# EAGLE design uSupply_upgrade (EAGLE 6.4)

## Sheet 1 of 3: MCU Power
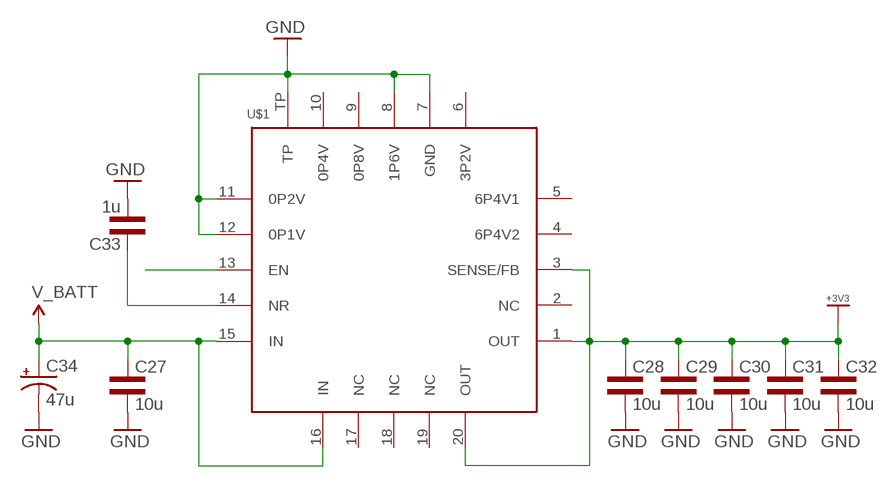
[diagram p0: schematic, sheet 1]

### Parts
C27  10u  CAP0805L3  [0805L3]
C28  10u  CAP0805L3  [0805L3]
C29  10u  CAP0805L3  [0805L3]
C30  10u  CAP0805L3  [0805L3]
C31  10u  CAP0805L3  [0805L3]
C32  10u  CAP0805L3  [0805L3]
C33  1u  CAP0603L3  [0603L3]
C34  47u  CPOL-USCT7343  [CT7343]
U$1  POWER-SUPPLY_POS_V1_TI_LDO_TPS7A4700  [POWER-SUPPLY_POS_V1_TI_LDO_VQFN-20]

### Nets
+3V3: C28.1 C29.1 C30.1 C31.1 C32.1 U$1.1(OUT) U$1.3(SENSE/FB) U$1.20(OUT) ; also sheet 2,3
GND: C27.2 C28.2 C29.2 C30.2 C31.2 C32.2 C33.P$2 C34.- U$1.7(GND) U$1.8(1P6V) U$1.11(0P2V) U$1.12(0P1V) U$1.TP ; also sheet 2,3
N$29: C33.P$1 U$1.14(NR)
N$33: U$1.13(EN)
V_BATT: C27.1 C34.+ U$1.15(IN) U$1.16(IN) ; also sheet 3
Unconnected: U$1.2(NC) U$1.4(6P4V2) U$1.5(6P4V1) U$1.6(3P2V) U$1.9(0P8V) U$1.10(0P4V) U$1.17(NC) U$1.18(NC) U$1.19(NC)

## Sheet 2 of 3: MCU
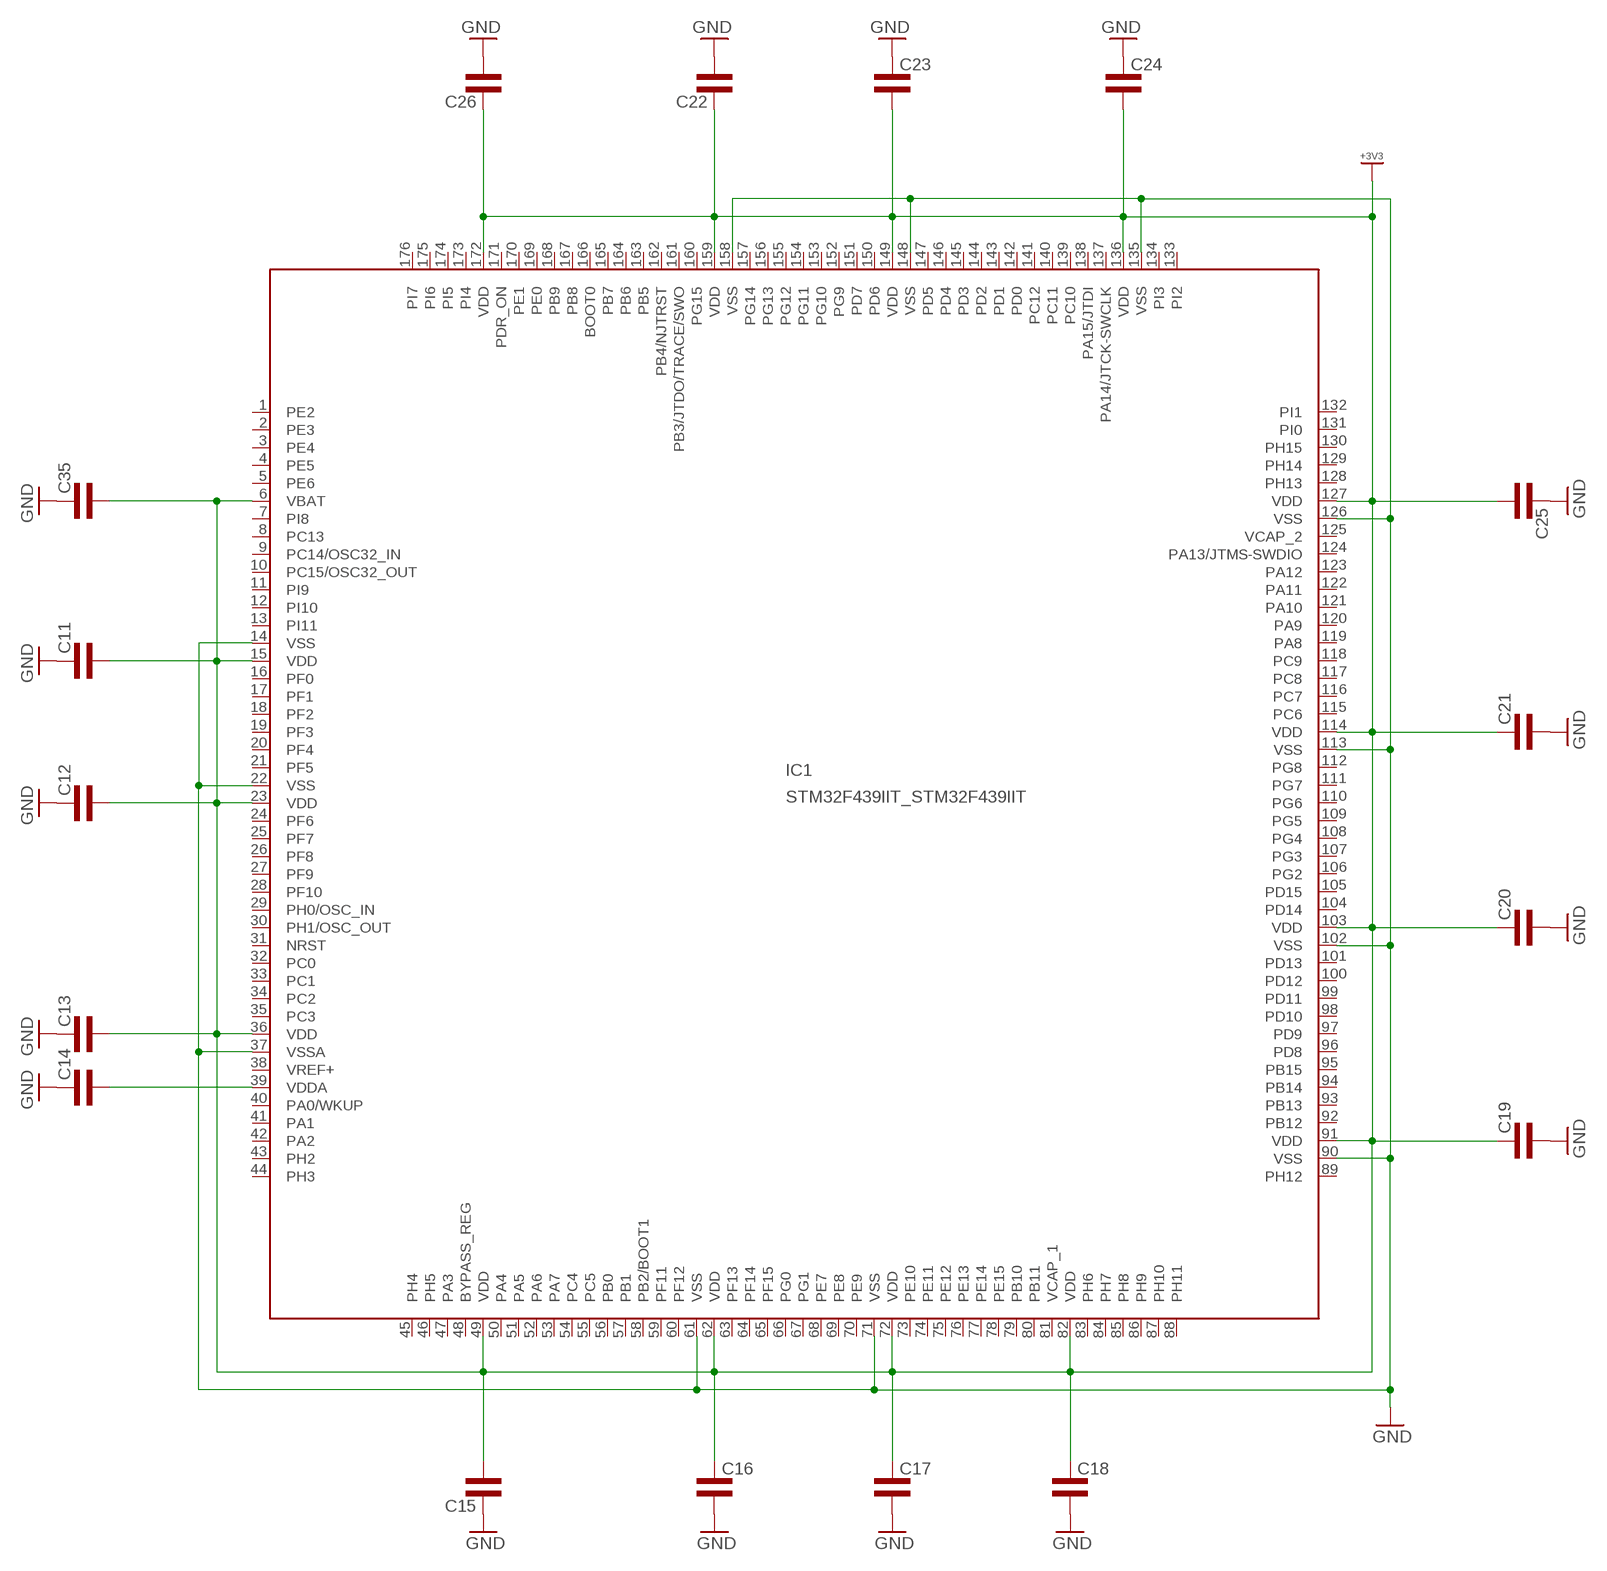
[diagram p1: schematic, sheet 2]

### Parts
C11  CAP0402L3  [0402L3]
C12  CAP0402L3  [0402L3]
C13  CAP0402L3  [0402L3]
C14  CAP0402L3  [0402L3]
C15  CAP0402L3  [0402L3]
C16  CAP0402L3  [0402L3]
C17  CAP0402L3  [0402L3]
C18  CAP0402L3  [0402L3]
C19  CAP0402L3  [0402L3]
C20  CAP0402L3  [0402L3]
C21  CAP0402L3  [0402L3]
C22  CAP0402L3  [0402L3]
C23  CAP0402L3  [0402L3]
C24  CAP0402L3  [0402L3]
C25  CAP0402L3  [0402L3]
C26  CAP0402L3  [0402L3]
C35  CAP0402L3  [0402L3]
IC1  STM32F439IIT_STM32F439IIT  [STM32F439IIT_LQFP-176]

### Nets
+3V3: C11.P$2 C12.P$2 C13.P$2 C15.P$2 C16.P$1 C17.P$1 C18.P$1 C19.P$1 C20.P$1 C21.P$1 C22.P$1 C23.P$2 C24.P$2 C25.P$2 C26.P$1 C35.P$2 IC1.6(VBAT) IC1.15(VDD) IC1.23(VDD) IC1.36(VDD) IC1.49(VDD) IC1.62(VDD) IC1.72(VDD) IC1.82(VDD) IC1.91(VDD) IC1.103(VDD) IC1.114(VDD) IC1.127(VDD) IC1.136(VDD) IC1.149(VDD) IC1.159(VDD) IC1.172(VDD) ; also sheet 1,3
GND: C11.P$1 C12.P$1 C13.P$1 C14.P$1 C15.P$1 C16.P$2 C17.P$2 C18.P$2 C19.P$2 C20.P$2 C21.P$2 C22.P$2 C23.P$1 C24.P$1 C25.P$1 C26.P$2 C35.P$1 IC1.14(VSS) IC1.22(VSS) IC1.37(VSSA) IC1.61(VSS) IC1.71(VSS) IC1.90(VSS) IC1.102(VSS) IC1.113(VSS) IC1.126(VSS) IC1.135(VSS) IC1.148(VSS) IC1.158(VSS) ; also sheet 1,3
N$25: C14.P$2 IC1.39(VDDA)
Unconnected: IC1.1(PE2) IC1.2(PE3) IC1.3(PE4) IC1.4(PE5) IC1.5(PE6) IC1.7(PI8) IC1.8(PC13) IC1.9(PC14/OSC32_IN) IC1.10(PC15/OSC32_OUT) IC1.11(PI9) IC1.12(PI10) IC1.13(PI11) IC1.16(PF0) IC1.17(PF1) IC1.18(PF2) IC1.19(PF3) IC1.20(PF4) IC1.21(PF5) IC1.24(PF6) IC1.25(PF7) IC1.26(PF8) IC1.27(PF9) IC1.28(PF10) IC1.29(PH0/OSC_IN) IC1.30(PH1/OSC_OUT) IC1.31(NRST) IC1.32(PC0) IC1.33(PC1) IC1.34(PC2) IC1.35(PC3) IC1.40(PA0/WKUP) IC1.41(PA1) IC1.42(PA2) IC1.43(PH2) IC1.44(PH3) IC1.45(PH4) IC1.46(PH5) IC1.47(PA3) IC1.48(BYPASS_REG) IC1.50(PA4) IC1.51(PA5) IC1.52(PA6) IC1.53(PA7) IC1.54(PC4) IC1.55(PC5) IC1.56(PB0) IC1.57(PB1) IC1.58(PB2/BOOT1) IC1.59(PF11) IC1.60(PF12) IC1.63(PF13) IC1.64(PF14) IC1.65(PF15) IC1.66(PG0) IC1.67(PG1) IC1.68(PE7) IC1.69(PE8) IC1.70(PE9) IC1.73(PE10) IC1.74(PE11) IC1.75(PE12) IC1.76(PE13) IC1.77(PE14) IC1.78(PE15) IC1.79(PB10) IC1.80(PB11) IC1.83(PH6) IC1.84(PH7) IC1.85(PH8) IC1.86(PH9) IC1.87(PH10) IC1.88(PH11) IC1.89(PH12) IC1.92(PB12) IC1.93(PB13) IC1.94(PB14) IC1.95(PB15) IC1.96(PD8) IC1.97(PD9) IC1.98(PD10) IC1.99(PD11) IC1.100(PD12) IC1.101(PD13) IC1.104(PD14) IC1.105(PD15) IC1.106(PG2) IC1.107(PG3) IC1.108(PG4) IC1.109(PG5) IC1.110(PG6) IC1.111(PG7) IC1.112(PG8) IC1.115(PC6) IC1.116(PC7) IC1.117(PC8) IC1.118(PC9) IC1.119(PA8) IC1.120(PA9) IC1.121(PA10) IC1.122(PA11) IC1.123(PA12) IC1.124(PA13/JTMS-SWDIO) IC1.128(PH13) IC1.129(PH14) IC1.130(PH15) IC1.131(PI0) IC1.132(PI1) IC1.133(PI2) IC1.134(PI3) IC1.137(PA14/JTCK-SWCLK) IC1.138(PA15/JTDI) IC1.139(PC10) IC1.140(PC11) IC1.141(PC12) IC1.142(PD0) IC1.143(PD1) IC1.144(PD2) IC1.145(PD3) IC1.146(PD4) IC1.147(PD5) IC1.150(PD6) IC1.151(PD7) IC1.152(PG9) IC1.153(PG10) IC1.154(PG11) IC1.155(PG12) IC1.156(PG13) IC1.157(PG14) IC1.160(PG15) IC1.161(PB3/JTDO/TRACE/SWO) IC1.162(PB4/NJTRST) IC1.163(PB5) IC1.164(PB6) IC1.165(PB7) IC1.166(BOOT0) IC1.167(PB8) IC1.168(PB9) IC1.169(PE0) IC1.170(PE1) IC1.173(PI4) IC1.174(PI5) IC1.175(PI6) IC1.176(PI7)

## Sheet 3 of 3: CH 1
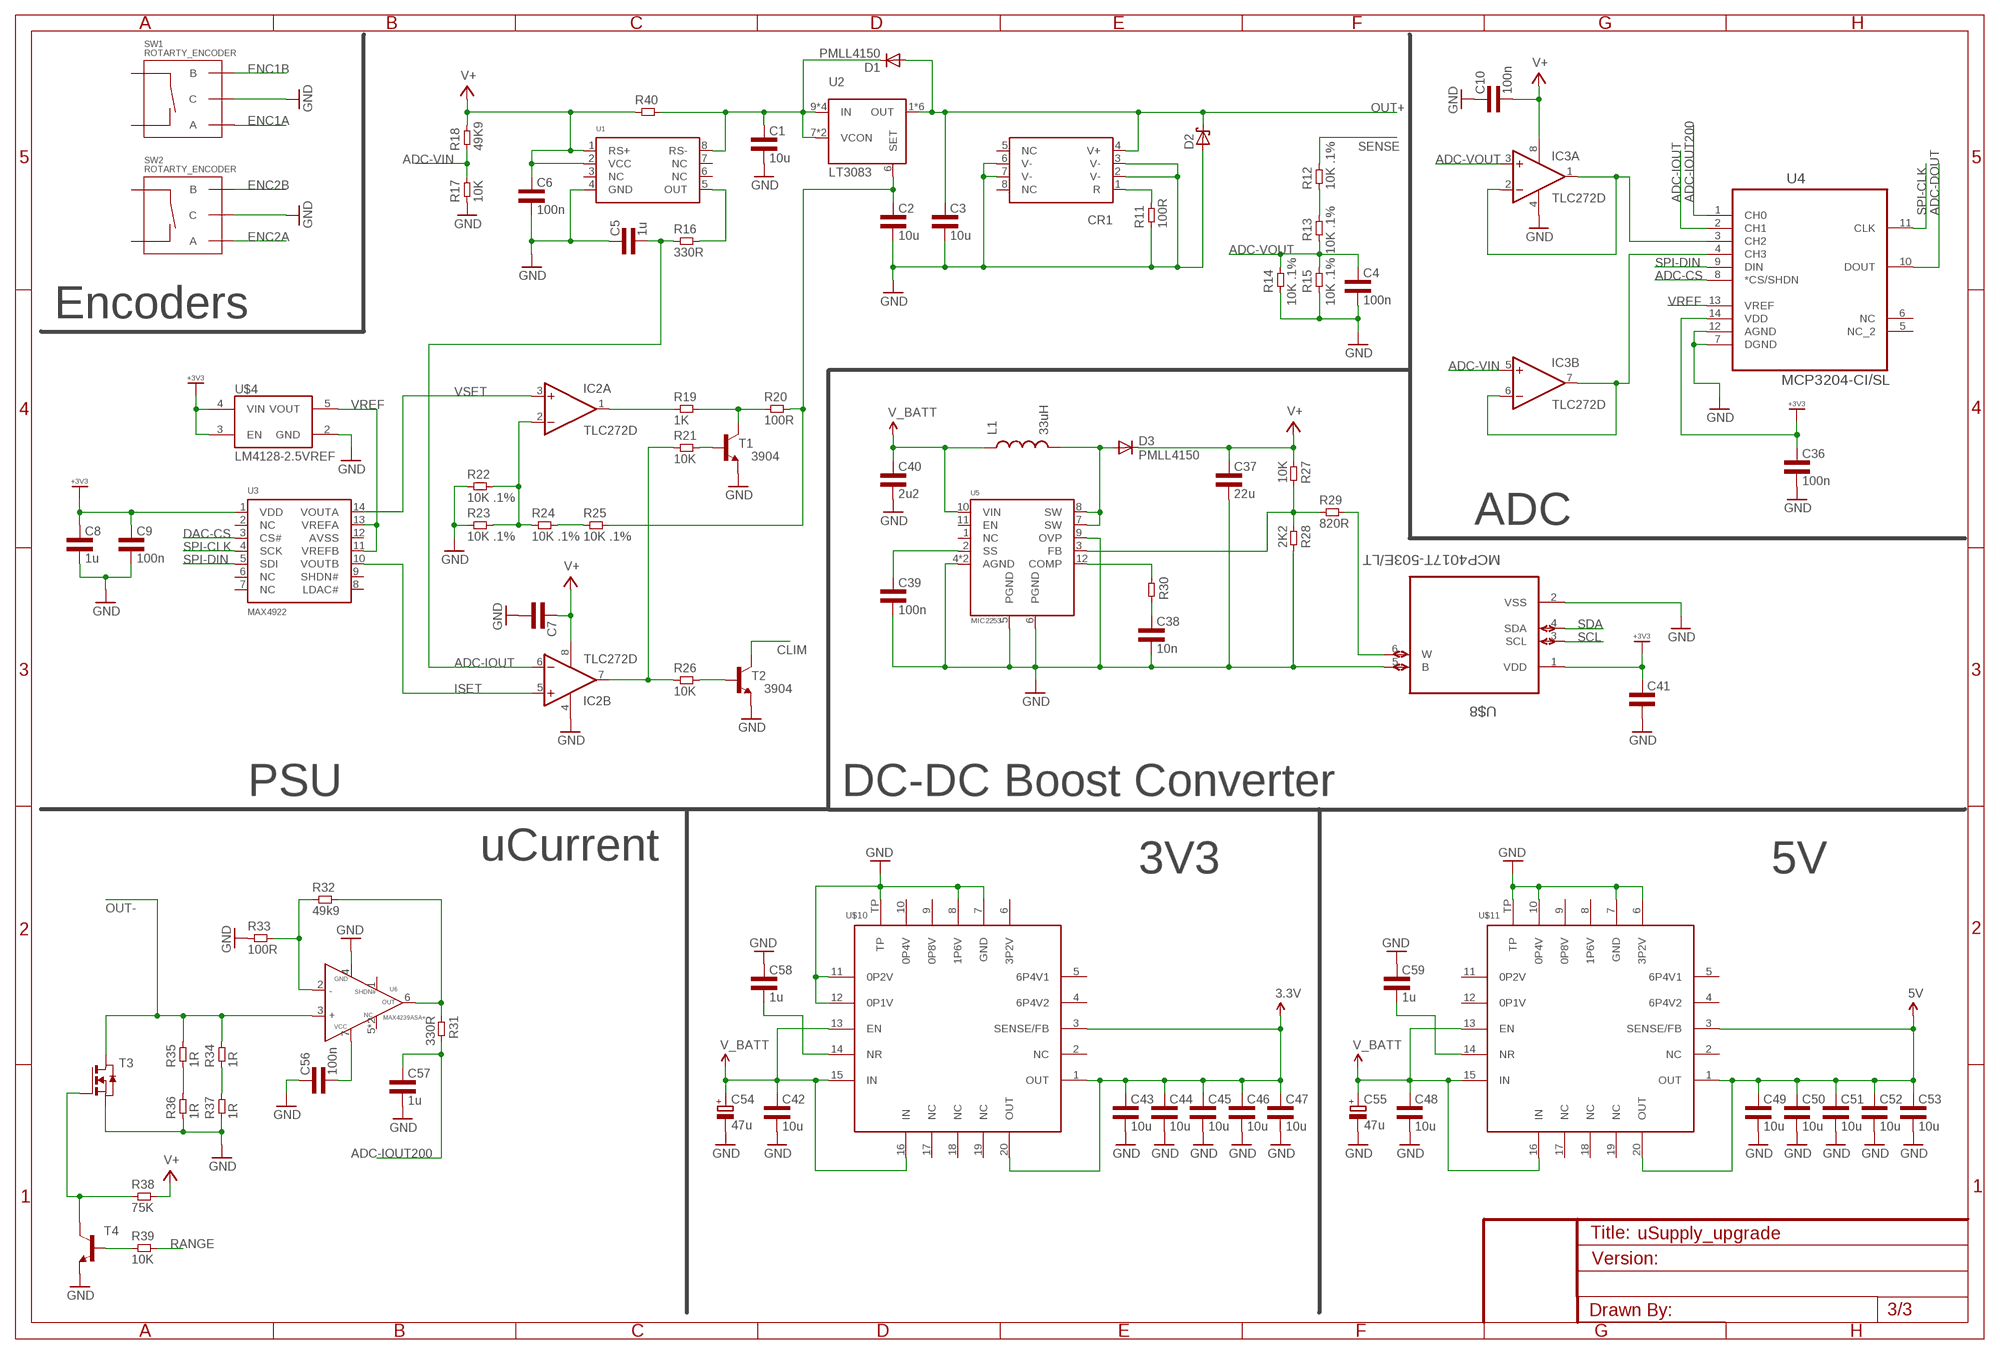
[diagram p2: schematic, sheet 3]

### Parts
C1  10u  CAP0805L3  [0805L3]
C2  10u  CAP0805L3  [0805L3]
C3  10u  CAP0805L3  [0805L3]
C4  100n  CAP0603L3  [0603L3]
C5  1u  CAP0603L3  [0603L3]
C6  100n  CAP0603L3  [0603L3]
C7  CAP0603L3  [0603L3]
C8  1u  CAP0603L3  [0603L3]
C9  100n  CAP0603L3  [0603L3]
C10  100n  CAP0603L3  [0603L3]
C36  100n  CAP0603L3  [0603L3]
C37  22u  CAP1206L3  [1206L3]
C38  10n  CAP0603L3  [0603L3]
C39  100n  CAP0603L3  [0603L3]
C40  2u2  CAP0603L3  [0603L3]
C41  CAP0603L3  [0603L3]
C42  10u  CAP0805L3  [0805L3]
C43  10u  CAP0805L3  [0805L3]
C44  10u  CAP0805L3  [0805L3]
C45  10u  CAP0805L3  [0805L3]
C46  10u  CAP0805L3  [0805L3]
C47  10u  CAP0805L3  [0805L3]
C48  10u  CAP0805L3  [0805L3]
C49  10u  CAP0805L3  [0805L3]
C50  10u  CAP0805L3  [0805L3]
C51  10u  CAP0805L3  [0805L3]
C52  10u  CAP0805L3  [0805L3]
C53  10u  CAP0805L3  [0805L3]
C54  47u  CPOL-EUCT7343  [CT7343]
C55  47u  CPOL-EUCT7343  [CT7343]
C56  100n  CAP0603L3  [0603L3]
C57  1u  CAP0603L3  [0603L3]
C58  1u  CAP0603L3  [0603L3]
C59  1u  CAP0603L3  [0603L3]
CR1  LM334  [R-PDSO-G8]
D1  PMLL4150  [SOD80C]
D2  SCHOTTKY-DIODESMD  [SMB]
D3  PMLL4150  [SOD80C]
IC2  TLC272D  [SO08]
IC3  TLC272D  [SO08]
L1  33uH  INDUCTORBOURNS_SRN6045  [SRN6045]
R11  100R  RES0603L3  [0603L3]
R12  10K .1%  RES0603L3  [0603L3]
R13  10K .1%  RES0603L3  [0603L3]
R14  10K .1%  RES0603L3  [0603L3]
R15  10K .1%  RES0603L3  [0603L3]
R16  330R  RES0603L3  [0603L3]
R17  10K  RES0603L3  [0603L3]
R18  49K9  RES0603L3  [0603L3]
R19  1K  RES0603L3  [0603L3]
R20  100R  RES0603L3  [0603L3]
R21  10K  RES0603L3  [0603L3]
R22  10K .1%  RES0603L3  [0603L3]
R23  10K .1%  RES0603L3  [0603L3]
R24  10K .1%  RES0603L3  [0603L3]
R25  10K .1%  RES0603L3  [0603L3]
R26  10K  RES0603L3  [0603L3]
R27  10K  RES0603L3  [0603L3]
R28  2K2  RES0603L3  [0603L3]
R29  820R  RES0603L3  [0603L3]
R30  RES0603L3  [0603L3]
R31  330R  RES0603L3  [0603L3]
R32  49k9  RES0603L3  [0603L3]
R33  100R  RES0603L3  [0603L3]
R34  1R  RES1206L3  [1206L3]
R35  1R  RES1206L3  [1206L3]
R36  1R  RES1206L3  [1206L3]
R37  1R  RES1206L3  [1206L3]
R38  75K  RES0603L3  [0603L3]
R39  10K  RES0603L3  [0603L3]
R40  RES4527L3  [4527L3]
SW1  ROTARTY_ENCODER  [ROTARY_ENC_PLAIN]
SW2  ROTARTY_ENCODER  [ROTARY_ENC_PLAIN]
T1  3904  MMBT3904LT1-NPN-SOT23-BEC  [SOT23-BEC]
T2  3904  MMBT3904LT1-NPN-SOT23-BEC  [SOT23-BEC]
T3  NMOSSOT23  [SOT-23]
T4  MMBT3904LT1-NPN-SOT23-BEC  [SOT23-BEC]
U1  MAX4080  [UMAX]
U2  LT3083  [DFN4X4]
U3  MCP4922  [TSSOP-14]
U4  MCP3204-CI/SL  [SOIC127P600X175-14N]
U5  MIC2253  [MLF3X3]
U6  MAX4239  [SOIC-8]
U$4  LM4128-2.5VREF  [SOT23-5]
U$8  MCP4017T-503E/LT  [SOT65P210X110-6N]
U$10  POWER-SUPPLY_POS_V1_TI_LDO_TPS7A4700  [POWER-SUPPLY_POS_V1_TI_LDO_VQFN-20]
U$11  POWER-SUPPLY_POS_V1_TI_LDO_TPS7A4700  [POWER-SUPPLY_POS_V1_TI_LDO_VQFN-20]

### Nets
3.3V: C43.1 C44.1 C45.1 C46.1 C47.1 U$10.1(OUT) U$10.3(SENSE/FB) U$10.20(OUT)
5V: C49.1 C50.1 C51.1 C52.1 C53.1 U$11.1(OUT) U$11.3(SENSE/FB) U$11.20(OUT)
+3V3: C8.P$1 C9.P$1 C36.P$1 C41.P$1 U3.1(VDD) U4.14(VDD) U$4.3(EN) U$4.4(VIN) U$8.1(VDD) ; also sheet 1,2
ADC-CS: U4.8(*CS/SHDN)
ADC-DOUT: U4.10(DOUT)
ADC-IOUT: C5.P$2 IC2.6(B:-IN) R16.P$1 U4.2(CH1)
ADC-IOUT200: C57.P$1 R31.P$2 U4.1(CH0)
ADC-VIN: IC3.5(B:+IN) R17.P$2 R18.P$1
ADC-VOUT: C4.P$1 IC3.3(A:+IN) R13.P$1 R14.P$2 R15.P$2
CLIM: T2.C
DAC-CS: U3.3(CS#)
ENC1A: SW1.A
ENC1B: SW1.B
ENC2A: SW2.A
ENC2B: SW2.B
GND: C1.2 C2.2 C3.2 C4.P$2 C5.P$1 C6.P$2 C7.P$2 C8.P$2 C9.P$2 C10.P$1 C36.P$2 C37.2 C38.P$2 C39.P$2 C40.P$2 C41.P$2 C42.2 C43.2 C44.2 C45.2 C46.2 C47.2 C48.2 C49.2 C50.2 C51.2 C52.2 C53.2 C54.- C55.- C56.P$1 C57.P$2 C58.P$1 C59.P$1 CR1.2(V-) CR1.3(V-) CR1.6(V-) CR1.7(V-) D2.A IC2.4(P:V-) IC3.4(P:V-) R11.P$1 R14.P$1 R15.P$1 R17.P$1 R22.P$1 R23.P$1 R28.P$2 R33.P$1 R36.1 R37.1 SW1.C SW2.C T1.E T2.E T3.2(S) T4.E U1.4(GND) U4.7(DGND) U4.12(AGND) U5.4(AGND) U5.5(PGND) U5.6(PGND) U5.9(OVP) U5.TP(AGND) U6.4(GND) U$4.2(GND) U$8.2(VSS) U$8.5(B) U$10.7(GND) U$10.8(1P6V) U$10.11(0P2V) U$10.12(0P1V) U$10.TP U$11.6(3P2V) U$11.7(GND) U$11.10(0P4V) U$11.TP ; also sheet 1,2
I_R: CR1.1(R) R11.P$2
ISET: IC2.5(B:+IN) U3.10(VOUTB)
N$1: IC3.1(A:OUT) IC3.2(A:-IN) U4.3(CH2)
N$2: C56.P$2 U6.7(VCC)
N$3: D3.A L1.2 U5.7(SW) U5.8(SW)
N$4: C59.P$2 U$11.14(NR)
N$5: R16.P$2 U1.5(OUT)
N$6: C58.P$2 U$10.14(NR)
N$7: R31.P$1 R32.P$2 U6.6(OUT)
N$8: IC3.6(B:-IN) IC3.7(B:OUT) U4.4(CH3)
N$9: R29.P$2 U$8.6(W)
N$10: R12.P$1 R13.P$2
N$11: R27.P$2 R28.P$1 R29.P$1 U5.3(FB)
N$12: R30.P$1 U5.12(COMP)
N$13: C38.P$1 R30.P$2
N$14: IC2.1(A:OUT) R19.P$1
N$15: R19.P$2 R20.P$1 T1.C
N$16: R21.P$2 T1.B
N$17: IC2.2(A:-IN) R22.P$2 R23.P$2 R24.P$1
N$18: R24.P$2 R25.P$1
N$20: R32.P$1 R33.P$2 U6.2(-)
N$22: C39.P$1 U5.2(SS)
N$23: IC2.7(B:OUT) R21.P$1 R26.P$1
N$24: R26.P$2 T2.B
N$27: R34.1 R37.2
N$28: R35.1 R36.2
N$31: R38.P$1 T3.3(G) T4.C
N$32: R39.P$1 T4.B
OUT+: C3.1 CR1.4(V+) D1.A D2.C U2.1(OUT) U2.2(OUT) U2.3(OUT) U2.4(OUT) U2.5(OUT) U2.TP(OUT)
OUT-: R34.2 R35.2 T3.1(D) U6.3(+)
RANGE: R39.P$2
SCL: U$8.3(SCL)
SDA: U$8.4(SDA)
SENSE: R12.P$2
SET: C2.1 R20.P$2 R25.P$2 U2.6(SET)
SPI-CLK: U3.4(SCK) U4.11(CLK)
SPI-DIN: U3.5(SDI) U4.9(DIN)
V+: C6.P$1 C7.P$1 C10.P$2 C37.1 D3.C IC2.8(P:V+) IC3.8(P:V+) R18.P$2 R27.P$1 R38.P$2 R40.1 U1.1(RS+) U1.2(VCC)
V+_REG: C1.1 D1.C R40.2 U1.8(RS-) U2.7(VCON) U2.8(VCON) U2.9(IN) U2.10(IN) U2.11(IN) U2.12(IN)
V_BATT: C40.P$1 C42.1 C48.1 C54.+ C55.+ L1.1 U5.10(VIN) U$10.13(EN) U$10.15(IN) U$10.16(IN) U$11.13(EN) U$11.15(IN) U$11.16(IN) ; also sheet 1
VREF: U3.11(VREFB) U3.13(VREFA) U4.13(VREF) U$4.5(VOUT)
VSET: IC2.3(A:+IN) U3.14(VOUTA)
Unconnected: CR1.5(NC) CR1.8(NC) SW1.SW+ SW1.SW- SW2.SW+ SW2.SW- U1.3(NC) U1.6(NC) U1.7(NC) U3.2(NC) U3.6(NC) U3.7(NC) U3.8(LDAC#) U3.9(SHDN#) U3.12(AVSS) U4.5(NC_2) U4.6(NC) U5.1(NC) U5.11(EN) U6.1(SHDN#) U6.5(NC) U6.8(NC) U$10.2(NC) U$10.4(6P4V2) U$10.5(6P4V1) U$10.6(3P2V) U$10.9(0P8V) U$10.10(0P4V) U$10.17(NC) U$10.18(NC) U$10.19(NC) U$11.2(NC) U$11.4(6P4V2) U$11.5(6P4V1) U$11.8(1P6V) U$11.9(0P8V) U$11.11(0P2V) U$11.12(0P1V) U$11.17(NC) U$11.18(NC) U$11.19(NC)

### Notes on the sheet
- Encoders
- ADC
- PSU | DC-DC Boost Converter
- uCurrent | 3V3 | 5V

## Power pins joined to a net without a drawn wire
PDR_ON: IC1.171(PDR_ON)
VCAP_1: IC1.81(VCAP_1)
VCAP_2: IC1.125(VCAP_2)
VREF+: IC1.38(VREF+)

## Library data of the parts
C1-C33 C35-C53 C56-C59 = common:CAP
C34 = rcl:CPOL-US: POLARIZED CAPACITOR, American symbol
C54 C55 = rcl:CPOL-EU: POLARIZED CAPACITOR, European symbol
CR1 = common:LM334
D1 D3 = diode:PMLL4150: DIODE high speed
D2 = diode:SCHOTTKY-DIODE: Schottky Diode
IC1 = Logic - Copy:STM32F439IIT_STM32F439IIT: edit this description Auto generated by make-symbol-device-package-bsdl.ulp Rev. 43 Source:
IC2 IC3 = linear:TLC272: OP AMP
L1 = SparkFun-Passives:INDUCTOR: Inductors Basic Inductor/Choke - 0603 and 1206. Footprints are not proven and vary greatly between part numbers. SRN6045- 33uH, 20% 1.4A; PROD_ID: NDUC-11627
R11-R40 = common:RES
SW1 SW2 = SparkFun-Electromechanical:ROTARTY_ENCODER: Simple no LED rotary encoder Example: COM-09117
T1 T2 T4 = transistor:*-NPN-: NPN Transistror BF959 corrected 2008.03.06
T3 = zetex:NMOSSOT23: MOS FET; OC_FARNELL: unknown; OC_NEWARK: unknown
U1 = common:MAX4080: High-side current-sense amplifier. 4.5V to 76V.
U2 = common:LT3083
U3 = common:MCP4922
U4 = Microchip_By_element14_Batch_1:MCP3204-CI/SL: IC ADC 12BIT 2.7V 4CH SPI; MPN: MCP3204-CI/SL; OC_FARNELL: 1196795; OC_NEWARK: 26M1276; PACKAGE: 14 - SOIC; SUPPLIER: Microchip
U5 = common:MIC2253: Boost Regulator
U6 = common:MAX4239: The MAX4238/MAX4239 are low-noise, low-drift, ultrahigh precision amplifiers that offer near-zero DC offset and drift through the use of patented autocorrelating zeroing techniques. This method constantly measures and compensates the input offset, eliminating drift over time and temperature and the effect of 1/f noise. Both devices feature rail-to-rail outputs, operate from a single 2.7V to 5.5V supply, and consume only 600µA. An activelow shutdown mode decreases supply current to 0.1µA.
U$1 U$10 U$11 = my_dac_amp:POWER-SUPPLY_POS_V1_TI_LDO_TPS7A4700
U$4 = SparkFun-PowerIC:LM4128-2.5VREF: .1% accurate low-current voltage reference
U$8 = Microchip_By_element14_Batch_1:MCP4017T-503E/LT: Digital POT; MPN: MCP4017T-503E/LT; OC_FARNELL: 1825017; OC_NEWARK: 08R1800; PACKAGE: SOT-6; SUPPLIER: Microchip

## Board
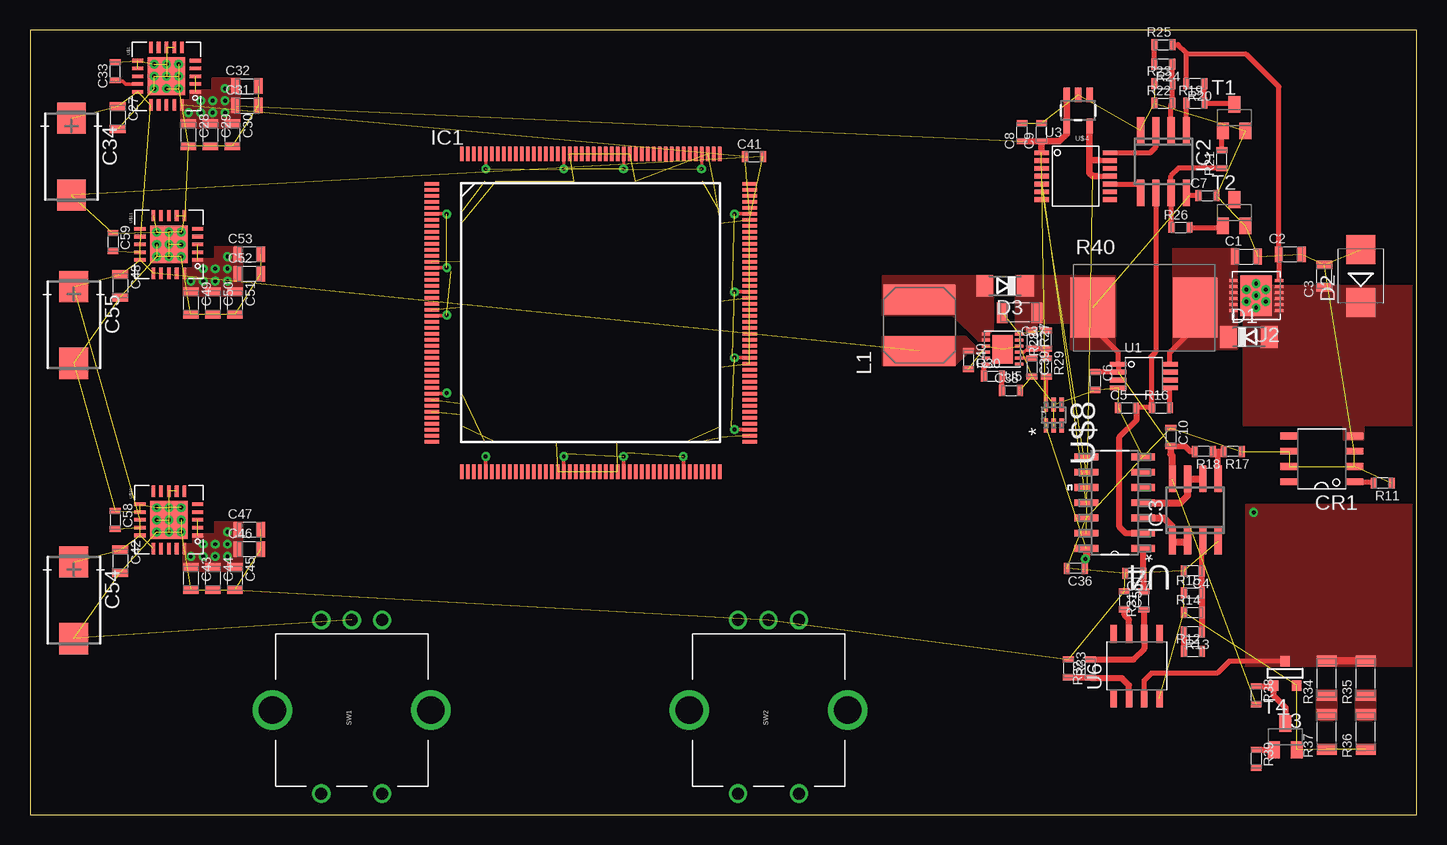
[diagram p3: board, top side]
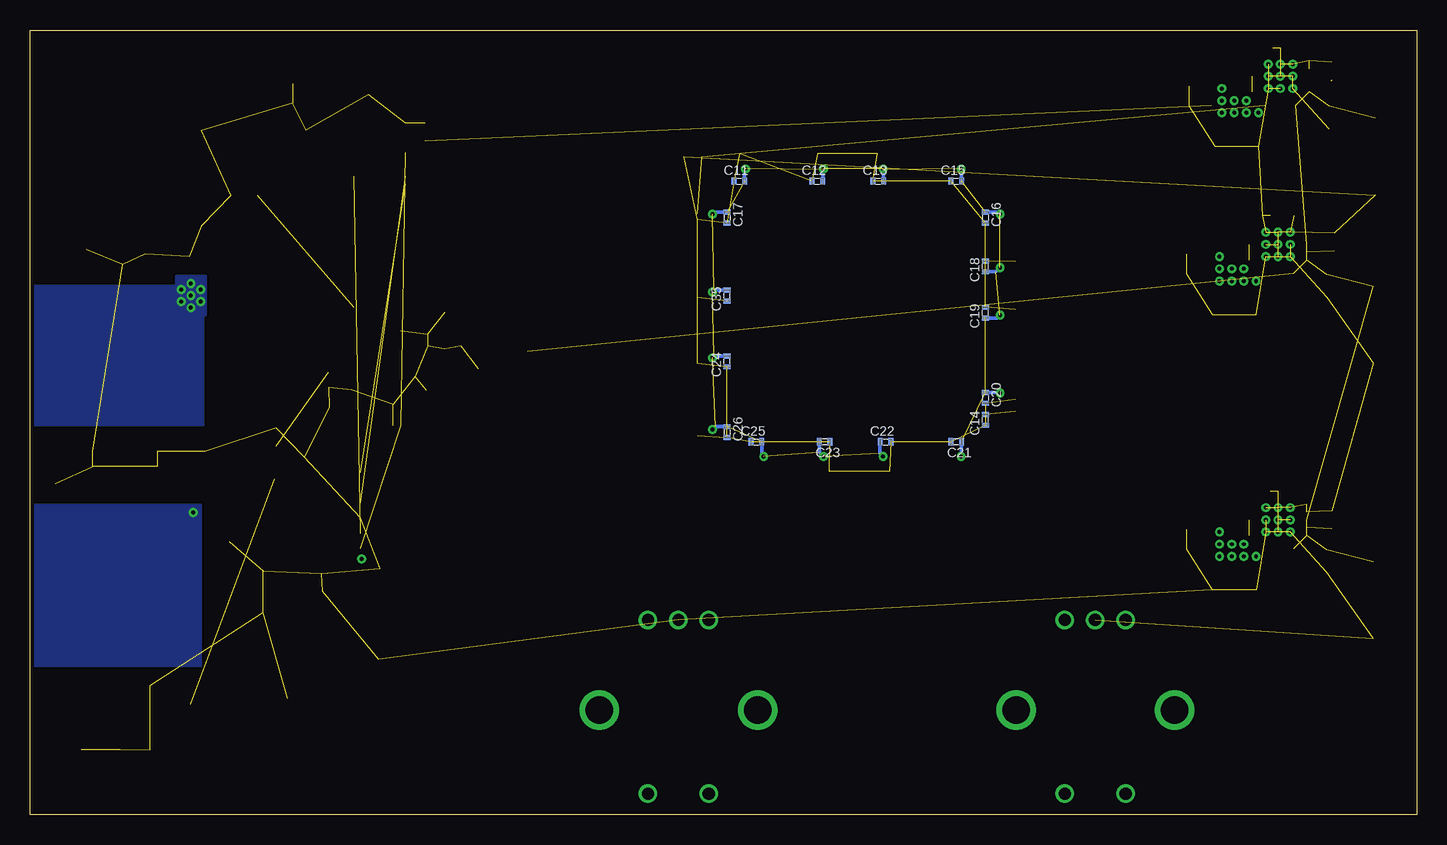
[diagram p4: board, bottom side, seen from below]

Size 115.62 x 65.43 mm. Coordinates in mm from the lower left corner, seen from the top.
Outline: 0,0 115.62,0 115.62,65.43 0,65.43 0,0
Copper layers (1*16): Top 0.035mm / dielectric 1.5mm / Bottom 0.035mm
Design rules "default *": minimum track width 10mil, minimum drill 13mil, track to track 8mil, track to pad 8mil, pad to pad 8mil, via to via 8mil, smd to smd 8mil, copper to edge 13mil, drill to drill 8mil, minimum pad ring 10mil, minimum via ring 8mil, stop-mask expansion 4mil, vias tented up to drill 0mil, thermal gap 10mil

### Footprints (pad centres in the part's own frame; a part is rotated, then mirrored left to right if it is on the bottom)
0805L3 = smd 0.7 x 1.3: 1 -0.95,0; 2 0.95,0
0603L3 = smd 0.5 x 0.9: P$1 -0.75,0; P$2 0.75,0
0402L3 = smd 0.4 x 0.6: P$1 -0.45,0; P$2 0.45,0
CT7343 = smd 2.6 x 2.4: + -3.2,0; - 3.2,0
1206L3 = smd 0.9 x 1.7: 1 -1.45,0; 2 1.45,0
R-PDSO-G8 = smd 0.55 x 1.5: 1 -1.905,-2.7; 2 -0.635,-2.7; 3 0.635,-2.7; 4 1.905,-2.7; 5 1.905,2.7; 6 0.635,2.7; 7 -0.635,2.7; 8 -1.905,2.7
SOD80C = smd 1.4 x 1.8: A 1.7,0; C -1.7,0
SMB = smd 2.4 x 2.4: A 2.2,0; C -2.2,0
STM32F439IIT_LQFP-176 = smd 1.2 x 0.3: 1 -13.25,10.75; 2 -13.25,10.25; 3 -13.25,9.75; 4 -13.25,9.25; 5 -13.25,8.75; 6 -13.25,8.25; 7 -13.25,7.75; 8 -13.25,7.25; 9 -13.25,6.75; 10 -13.25,6.25; 11 -13.25,5.75; 12 -13.25,5.25; 13 -13.25,4.75; 14 -13.25,4.25; 15 -13.25,3.75; 16 -13.25,3.25; 17 -13.25,2.75; 18 -13.25,2.25; 19 -13.25,1.75; 20 -13.25,1.25; 21 -13.25,0.75; 22 -13.25,0.25; 23 -13.25,-0.25; 24 -13.25,-0.75; 25 -13.25,-1.25; 26 -13.25,-1.75; 27 -13.25,-2.25; 28 -13.25,-2.75; 29 -13.25,-3.25; 30 -13.25,-3.75; 31 -13.25,-4.25; 32 -13.25,-4.75; 33 -13.25,-5.25; 34 -13.25,-5.75; 35 -13.25,-6.25; 36 -13.25,-6.75; 37 -13.25,-7.25; 38 -13.25,-7.75; 39 -13.25,-8.25; 40 -13.25,-8.75; 41 -13.25,-9.25; 42 -13.25,-9.75; 43 -13.25,-10.25; 44 -13.25,-10.75; 89 13.25,-10.75; 90 13.25,-10.25; 91 13.25,-9.75; 92 13.25,-9.25; 93 13.25,-8.75; 94 13.25,-8.25; 95 13.25,-7.75; 96 13.25,-7.25; 97 13.25,-6.75; 98 13.25,-6.25; 99 13.25,-5.75; 100 13.25,-5.25; 101 13.25,-4.75; 102 13.25,-4.25; 103 13.25,-3.75; 104 13.25,-3.25; 105 13.25,-2.75; 106 13.25,-2.25; 107 13.25,-1.75; 108 13.25,-1.25; 109 13.25,-0.75; 110 13.25,-0.25; 111 13.25,0.25; 112 13.25,0.75; 113 13.25,1.25; 114 13.25,1.75; 115 13.25,2.25; 116 13.25,2.75; 117 13.25,3.25; 118 13.25,3.75; 119 13.25,4.25; 120 13.25,4.75; 121 13.25,5.25; 122 13.25,5.75; 123 13.25,6.25; 124 13.25,6.75; 125 13.25,7.25; 126 13.25,7.75; 127 13.25,8.25; 128 13.25,8.75; 129 13.25,9.25; 130 13.25,9.75; 131 13.25,10.25; 132 13.25,10.75 | smd 0.3 x 1.2: 45 -10.75,-13.25; 46 -10.25,-13.25; 47 -9.75,-13.25; 48 -9.25,-13.25; 49 -8.75,-13.25; 50 -8.25,-13.25; 51 -7.75,-13.25; 52 -7.25,-13.25; 53 -6.75,-13.25; 54 -6.25,-13.25; 55 -5.75,-13.25; 56 -5.25,-13.25; 57 -4.75,-13.25; 58 -4.25,-13.25; 59 -3.75,-13.25; 60 -3.25,-13.25; 61 -2.75,-13.25; 62 -2.25,-13.25; 63 -1.75,-13.25; 64 -1.25,-13.25; 65 -0.75,-13.25; 66 -0.25,-13.25; 67 0.25,-13.25; 68 0.75,-13.25; 69 1.25,-13.25; 70 1.75,-13.25; 71 2.25,-13.25; 72 2.75,-13.25; 73 3.25,-13.25; 74 3.75,-13.25; 75 4.25,-13.25; 76 4.75,-13.25; 77 5.25,-13.25; 78 5.75,-13.25; 79 6.25,-13.25; 80 6.75,-13.25; 81 7.25,-13.25; 82 7.75,-13.25; 83 8.25,-13.25; 84 8.75,-13.25; 85 9.25,-13.25; 86 9.75,-13.25; 87 10.25,-13.25; 88 10.75,-13.25; 133 10.75,13.25; 134 10.25,13.25; 135 9.75,13.25; 136 9.25,13.25; 137 8.75,13.25; 138 8.25,13.25; 139 7.75,13.25; 140 7.25,13.25; 141 6.75,13.25; 142 6.25,13.25; 143 5.75,13.25; 144 5.25,13.25; 145 4.75,13.25; 146 4.25,13.25; 147 3.75,13.25; 148 3.25,13.25; 149 2.75,13.25; 150 2.25,13.25; 151 1.75,13.25; 152 1.25,13.25; 153 0.75,13.25; 154 0.25,13.25; 155 -0.25,13.25; 156 -0.75,13.25; 157 -1.25,13.25; 158 -1.75,13.25; 159 -2.25,13.25; 160 -2.75,13.25; 161 -3.25,13.25; 162 -3.75,13.25; 163 -4.25,13.25; 164 -4.75,13.25; 165 -5.25,13.25; 166 -5.75,13.25; 167 -6.25,13.25; 168 -6.75,13.25; 169 -7.25,13.25; 170 -7.75,13.25; 171 -8.25,13.25; 172 -8.75,13.25; 173 -9.25,13.25; 174 -9.75,13.25; 175 -10.25,13.25; 176 -10.75,13.25
SO08 = smd 0.6 x 2.2: 1 -1.905,-2.6; 2 -0.635,-2.6; 3 0.635,-2.6; 4 1.905,-2.6; 5 1.905,2.6; 6 0.635,2.6; 7 -0.635,2.6; 8 -1.905,2.6
SRN6045 = smd 2.5 x 6: 1 -2.175,-0.175; 2 2.125,-0.175
4527L3 = smd 3.7 x 5: 1 -4.275,0; 2 4.275,0
ROTARY_ENC_PLAIN = drill 1.016: A 7.493,-2.54; B 7.493,2.54; C 7.493,0; SW+ -6.985,2.54; SW- -6.985,-2.54 | drill 2.286: P$3 0,6.604; P$4 0,-6.604
SOT23-BEC = smd 1 x 1.4: B -0.95,-1.1; C 0,1.1; E 0.95,-1.1
SOT-23 = smd 0.787 x 0.889: 1 0.025,-1.016; 2 -0.94,1.016; 3 0.991,1.016
UMAX = smd 0.4 x 1.35: 1 -0.975,-2.15; 2 -0.325,-2.15; 3 0.325,-2.15; 4 0.975,-2.15; 5 0.975,2.15; 6 0.325,2.15; 7 -0.325,2.15; 8 -0.975,2.15
DFN4X4 = smd 0.25 x 0.7: 1 -1.25,-1.9; 2 -0.75,-1.9; 3 -0.25,-1.9; 4 0.25,-1.9; 5 0.75,-1.9; 6 1.25,-1.9; 7 1.25,1.9; 8 0.75,1.9; 9 0.25,1.9; 10 -0.25,1.9; 11 -0.75,1.9; 12 -1.25,1.9 | smd 3.38 x 2.65: TP 0,0
TSSOP-14 = smd 1.2 x 0.4: 1 -2.85,1.95; 2 -2.85,1.3; 3 -2.85,0.65; 4 -2.85,0; 5 -2.85,-0.65; 6 -2.85,-1.3; 7 -2.85,-1.95; 8 2.85,-1.95; 9 2.85,-1.3; 10 2.85,-0.65; 11 2.85,0; 12 2.85,0.65; 13 2.85,1.3; 14 2.85,1.95
SOIC127P600X175-14N = smd 1.981 x 0.559: 1 -2.362,3.81; 2 -2.362,2.54; 3 -2.362,1.27; 4 -2.362,0; 5 -2.362,-1.27; 6 -2.362,-2.54; 7 -2.362,-3.81; 8 2.362,-3.81; 9 2.362,-2.54; 10 2.362,-1.27; 11 2.362,0; 12 2.362,1.27; 13 2.362,2.54; 14 2.362,3.81
MLF3X3 = smd 0.25 x 0.7: 1 -1.25,-1.39; 2 -0.75,-1.39; 3 -0.25,-1.39; 4 0.25,-1.39; 5 0.75,-1.39; 6 1.25,-1.39; 7 1.25,1.39; 8 0.75,1.39; 9 0.25,1.39; 10 -0.25,1.39; 11 -0.75,1.39; 12 -1.25,1.39 | smd 2.4 x 1.68: TP 0,0
SOIC-8 = smd 0.55 x 1.5: 1 -1.905,-2.7; 2 -0.635,-2.7; 3 0.635,-2.7; 4 1.905,-2.7; 5 1.905,2.7; 6 0.635,2.7; 7 -0.635,2.7; 8 -1.905,2.7
POWER-SUPPLY_POS_V1_TI_LDO_VQFN-20 = smd 0.3 x 0.95: 1 -1.3,-2.4; 2 -0.65,-2.4; 3 0,-2.4; 4 0.65,-2.4; 5 1.3,-2.4; 11 1.3,2.4; 12 0.65,2.4; 13 0,2.4; 14 -0.65,2.4; 15 -1.3,2.4 | smd 0.95 x 0.3: 6 2.4,-1.3; 7 2.4,-0.65; 8 2.4,0; 9 2.4,0.65; 10 2.4,1.3; 16 -2.4,1.3; 17 -2.4,0.65; 18 -2.4,0; 19 -2.4,-0.65; 20 -2.4,-1.3 | smd 3.15 x 3.15: TP 0,0
SOT23-5 = smd 0.55 x 1.2: 1 -0.95,-1.3; 2 0,-1.3; 3 0.95,-1.3; 4 0.95,1.3; 5 -0.95,1.3
SOT65P210X110-6N = smd 1.168 x 0.356: 1 -0.889,0.66; 2 -0.889,0; 3 -0.889,-0.66; 4 0.889,-0.66; 5 0.889,0; 6 0.889,0.66

### Placement (x,y rotation side)
C1  101.4,46.53 0 top
C2  105.05,46.74 0 top
C3  107.9,44.91 90 top
C4  96.93,20.32 180 top
C5  91.44,33.93 0 top
C6  88.8,36.17 270 top
C7  98.15,51.61 0 top
C8  82.7,56.9 90 top
C9  84.33,56.9 90 top
C10  95.1,31.5 270 top
C11  56.49,52.83 0 bottom
C12  49.99,52.83 0 bottom
C13  44.91,52.83 0 bottom
C14  35.97,32.92 90 bottom
C15  38.4,52.83 0 bottom
C16  35.97,49.78 270 bottom
C17  57.51,49.78 270 bottom
C18  35.97,45.72 90 bottom
C19  35.97,41.86 90 bottom
C20  35.97,34.75 270 bottom
C21  38.4,31.09 180 bottom
C22  44.3,31.09 0 bottom
C23  49.38,31.09 180 bottom
C24  57.51,37.8 90 bottom
C25  55.07,31.09 0 bottom
C26  57.51,31.9 270 bottom
C27  7.32,58.12 270 top
C28  13.21,56.69 270 top
C29  15.04,56.69 270 top
C30  16.87,56.69 270 top
C31  18.08,59.13 0 top
C32  18.08,60.76 0 top
C33  7.11,61.98 90 top
C34  3.45,54.86 270 top
C35  57.51,43.28 90 bottom
C36  87.17,20.52 180 top
C37  82.5,41.86 180 top
C38  81.79,35.36 0 top
C39  83.52,37.29 270 top
C40  78.23,37.9 270 top
C41  60.35,54.86 0 top
C42  7.52,21.13 270 top
C43  13.41,19.71 270 top
C44  15.24,19.71 270 top
C45  17.07,19.71 270 top
C46  18.29,22.15 0 top
C47  18.29,23.77 0 top
C48  7.52,44.09 270 top
C49  13.41,42.67 270 top
C50  15.24,42.67 270 top
C51  17.07,42.67 270 top
C52  18.29,45.11 0 top
C53  18.29,46.74 0 top
C54  3.66,17.88 270 top
C55  3.66,40.84 270 top
C56  91.24,17.88 270 top
C57  92.05,20.12 180 top
C58  7.11,24.59 270 top
C59  6.91,47.75 270 top
CR1  107.7,29.67 90 top
D1  101.6,39.83 0 top
D2  110.95,44.91 90 top
D3  81.28,44.09 180 top
IC1  46.74,41.86 0 top
IC2  94.49,54.46 180 top
IC3  97.13,25.4 0 top
L1  73.96,40.84 90 top
R11  112.78,27.64 180 top
R12  96.93,13.61 0 top
R13  96.93,15.24 180 top
R14  96.93,16.87 0 top
R15  96.93,18.49 0 top
R16  94.28,33.93 0 top
R17  100.28,30.28 180 top
R18  97.84,30.28 180 top
R19  97.13,59.33 0 top
R20  97.13,60.96 180 top
R21  99.36,54.66 90 top
R22  94.49,59.33 0 top
R23  94.49,60.96 0 top
R24  94.49,62.59 180 top
R25  94.49,64.21 0 top
R26  95.91,48.97 0 top
R27  83.52,39.62 270 top
R28  84.73,39.62 90 top
R29  84.73,37.29 270 top
R30  80.26,36.58 0 top
R31  92.86,17.88 90 top
R32  88.39,12.19 90 top
R33  86.56,12.19 270 top
R34  108.1,11.38 90 top
R35  111.35,11.38 90 top
R36  111.35,6.91 90 top
R37  108.1,6.91 90 top
R38  102.21,9.96 270 top
R39  102.21,4.67 270 top
R40  92.86,42.27 0 top
SW1  26.82,8.74 90 top
SW2  61.57,8.74 90 top
T1  100.38,58.12 0 top
T2  100.38,50.19 0 top
T3  104.65,11.79 180 top
T4  104.65,6.5 0 top
U1  92.86,36.58 270 top
U2  102.21,43.28 90 top
U3  87.17,53.24 0 top
U4  90.42,26.01 180 top
U5  81.08,38.81 90 top
U6  92.25,12.4 0 top
U$1  11.38,61.57 90 top
U$4  87.38,58.72 180 top
U$8  85.34,33.32 90 top
U$10  11.58,24.59 90 top
U$11  11.58,47.55 90 top

### Tracks (layer width: path | path; a pad name or v marks a point on that pad's centre or on a via)
3.3V  (via drill 0.33)  (1 unrouted)
  other vias: 13.41,21.54 14.43,21.54 15.44,21.54 16.46,21.54 14.43,22.56 15.44,22.56 16.46,22.56 16.46,23.57
  pour Top (no thermals): 17.68,24.38 15.44,24.38 15.44,23.37 13.61,23.37 13.61,22.56 12.8,22.56 12.8,20.32 17.68,20.32
5V  (via drill 0.33)  (1 unrouted)
  other vias: 13.41,44.5 14.43,44.5 15.44,44.5 16.46,44.5 16.46,45.52 15.44,45.52 14.43,45.52 16.46,46.53
  pour Top (no thermals): 12.8,45.52 12.8,43.28 17.68,43.28 17.68,47.35 15.44,47.35 15.44,46.33 13.61,46.33 13.61,45.52
+3V3  (via drill 0.33)  (21 unrouted)
  Top 0.254: IC1.172 37.99,53.86 v38,53.85 | IC1.159 44.49,53.86 v44.5,53.85 | IC1.149 v49.49,53.85 v49.48,53.85 | IC1.136 v55.99,53.85 v55.98,53.85
  Top 0.305: IC1.6 34.73,50.11 v34.75,50.09 | IC1.15 34.74,45.61 v34.75,45.62 | IC1.127 58.75,50.11 v58.73,50.09 | IC1.114 58.75,43.61 v58.73,43.59 | IC1.103 58.73,38.11 v58.73,38.1 | IC1.23 34.7,41.61 v34.75,41.66 | IC1.36 34.7,35.11 v34.75,35.15 | IC1.91 v58.73,32.11 | IC1.82 54.49,29.84 v54.46,29.87 | IC1.72 v49.49,29.86 v49.48,29.87 | IC1.62 44.49,29.86 v44.5,29.87 | IC1.49 37.99,29.86 v38,29.87
  Top 0.406: U3.1 84.32,55.27 84.33,55.27
  Top 0.508: C8.P$1 C9.P$1
  Top 0.559: 84.33,55.27 C9.P$1 85.81,56.15 86.43,56.76 U$4.4 U$4.3
  Top 0.584: U4.14 88.06,21.41 v87.99,21.34 87.92,21.27 C36.P$1
  Bottom 0.305: C11.P$2 56.04,53.79 v55.98,53.85 | C12.P$2 49.54,53.79 v49.48,53.85 | C13.P$2 44.46,53.8 v44.5,53.85 | C15.P$2 37.96,53.8 v38,53.85 | C20.P$1 34.79,35.2 v34.75,35.15 | C19.P$1 34.99,41.41 v34.75,41.66 | C21.P$1 37.96,29.91 v38,29.87 | C22.P$1 44.75,30.12 v44.5,29.87 | C23.P$2 49.83,30.22 v49.48,29.87 | C25.P$2 54.62,30.03 v54.46,29.87 | C26.P$1 58.48,32.35 v58.73,32.11 | C24.P$2 58.58,38.25 v58.73,38.1 | C35.P$2 58.58,43.73 v58.73,43.59 | C17.P$1 58.58,50.23 v58.73,50.09 | C16.P$1 34.89,50.23 v34.75,50.09 | C18.P$1 35.1,45.27 v34.75,45.62
  other vias: 13.21,58.52 14.22,58.52 15.24,58.52 16.26,58.52 14.22,59.54 15.24,59.54 16.26,59.54 16.26,60.55
  pour Top (no thermals): 12.6,59.54 12.6,57.3 17.48,57.3 17.48,61.37 15.24,61.37 15.24,60.35 13.41,60.35 13.41,59.54
ADC-IOUT
  Top 0.406: C5.P$2 R16.P$1 93.47,34 93.47,38.2 93.85,38.58 IC2.6
  Top 0.508: U4.2 91.34,23.47 90.83,23.98 90.83,31.5 92.25,32.92 92.25,33.87 C5.P$2
ADC-IOUT200
  Top 0.508: R31.P$2 92.8,18.69 C57.P$1 U4.1
ADC-VIN
  Top 0.457: R18.P$1 99.16,30.28 | 99.16,30.28 R17.P$2 | IC3.5 99.03,30.15 99.16,30.28
ADC-VOUT
  Top 0.406: C4.P$1 97.68,22.71 IC3.3
  Top 0.508: C4.P$1 R15.P$2 R14.P$2 R13.P$1
GND  (via drill 0.33)  (143 unrouted)
  other vias: 11.38,61.57 10.36,62.59 11.38,62.59 12.4,62.59 12.4,61.57 10.36,61.57 10.36,60.55 11.38,60.55 12.4,60.55 11.58,24.59 11.58,47.55 11.58,25.6 11.58,23.57 10.57,23.57 12.6,23.57 10.57,24.59 10.57,25.6 12.6,25.6 12.6,24.59 11.58,46.53 11.58,48.56 10.57,48.56 12.6,48.56 10.57,46.53 12.6,46.53 12.6,47.55 10.57,47.55
I_R
  Top 0.406: CR1.1 111.9,27.76 R11.P$2
ISET
  Top 0.406: U3.10 92.29,52.59 92.58,52.3 IC2.5
N$1
  Top 0.584: IC3.2 96.45,22.76 95.3,22.76 95.26,22.8 IC3.1 95.22,24.05 94.54,24.74 U4.3
N$2
  Top 0.508: U6.7 91.62,16.28 91.24,16.66 C56.P$2
N$3
  pour Top (no thermals): 79.96,39.52 79.96,40.13 80.26,40.44 80.26,44.91 71.12,44.91 71.12,41.66 76.91,41.66 79.04,39.52
N$4  (1 unrouted)
N$5
  Top 0.406: R16.P$2 95.04,35.58 U1.5
N$6  (1 unrouted)
N$7
  Top 0.508: R31.P$1 92.89,17.11 U6.6 92.89,13.84 91.99,12.94 R32.P$2
N$8
  Top 0.584: IC3.6 IC3.7 96.49,26.59 95.91,26.01 U4.4
N$9
  Top 0.356: U$8.6 84.68,36.49 R29.P$2
N$10
  Top 0.508: R13.P$2 R12.P$1
N$11
  Top 0.254: U5.3 82.86,38.56 83.11,38.81 83.45,38.81 R27.P$2
  Top 0.406: R27.P$2 R28.P$1 R29.P$1
N$12
  Top 0.203: 79.65,37.39 79.65,37.53 U5.12
  Top 0.406: R30.P$1 79.51,37.25 79.65,37.39
N$13
  Top 0.406: C38.P$1 81.04,36.55 R30.P$2
N$14
  Top 0.406: IC2.1 96.39,59.32 R19.P$1
N$15
  Top 0.406: R20.P$1 R19.P$2 100.26,59.33 T1.C
N$16
  Top 0.406: R21.P$2 99.37,56.95 T1.B
N$17
  Top 0.406: IC2.2 95.12,59.22 R22.P$2 R23.P$2 R24.P$1
N$18
  Top 0.406: R24.P$2 R25.P$1
N$20
  Top 0.508: U6.2 91.62,10.8 91.03,11.38 88.46,11.38 R32.P$1 R33.P$2
N$22
  Top 0.254: U5.2 83.49,38.06 C39.P$1
N$23
  Top 0.406: R26.P$1 95.12,49.01 IC2.7 95.12,53.26 95.77,53.91 R21.P$1
N$24
  Top 0.406: R26.P$2 99.31,48.97 T2.B
N$25  (1 unrouted)
N$27
  pour Top (no thermals): 108.92,10.36 108.92,7.92 107.29,7.92 107.29,10.36
N$28
  pour Top (no thermals): 112.17,10.36 112.17,7.92 110.54,7.92 110.54,10.36
N$29  (1 unrouted)
  Top 0.279: U$1.14 7.97,60.92 7.72,61.16 7.18,61.16
N$31
  Top 0.508: R38.P$1 103.59,10.71 T3.3 103.66,9.93 104.65,8.94 T4.C
N$32
  Top 0.508: R39.P$1 103.68,5.42 T4.B
OUT+  (via drill 0.33)
  other vias: 102.21,43.28 102.21,44.3 102.21,42.27 103.02,42.77 103.02,43.79 101.4,43.79 101.4,42.77
  pour Top (no thermals): 100.99,44.91 103.43,44.91 103.43,44.09 115.42,44.09 115.42,32.51 101.19,32.51 101.19,41.66 100.99,41.66
  pour Bottom (no thermals): 100.99,44.91 103.43,44.91 103.43,44.09 115.42,44.09 115.42,32.51 101.19,32.51 101.19,41.66 100.99,41.66
  pour Top (no thermals): 111.15,31.29 111.15,33.93 109.52,33.93 109.52,31.29
OUT-  (via drill 0.33)
  Top 0.406: U6.3 92.89,11.2 93.47,11.79 98.96,11.79 99.97,12.8 T3.1
  Top 0.61: R34.2 R35.2
  other vias: 102.01,25.2
  pour Top (no thermals): 115.42,25.81 101.4,25.81 101.4,12.4 115.42,12.4
  pour Bottom (no thermals): 115.42,25.81 101.4,25.81 101.4,12.4 115.42,12.4
SET
  Top 0.254: U2.6 104.11,44.57 104.14,44.6
  Top 0.406: R25.P$2 95.71,64.21 96.38,63.54 96.38,63.4 | R20.P$2 96.38,63.4 | 96.38,63.4 101.4,63.4 104.1,60.69 C2.1 104.14,46.7 104.14,44.6
SPI-CLK  (1 unrouted)
SPI-DIN  (1 unrouted)
V+  (3 unrouted)
  Top 0.406: C7.P$1 96.64,51.61 IC2.8 | C6.P$1 88.82,36.9 U1.2 U1.1 90.71,38.52 88.6,40.64 R40.1 | 95.1,30.48 C10.P$2
  Top 0.457: R18.P$2 96.72,30.28 96.32,30.68 95.16,30.68 C10.P$2
  Top 0.559: 95.1,30.07 95.1,30.48
  Top 0.584: IC3.8 95.22,29.95 95.1,30.07
  pour Top (no thermals): 90.42,44.91 86.77,44.91 86.77,38.81 90.42,38.81
  pour Top (no thermals): 83.92,40.03 83.92,41.05 90.42,41.05 90.42,44.91 82.19,44.91 82.19,40.03
V+_REG
  Top 0.406: U1.8 95.01,38.52 97.13,40.64 97.13,42.26 R40.2
  pour Top (no thermals): 95.3,38.81 100.58,38.81 100.58,47.14 95.3,47.14
V_BATT  (14 unrouted)
  pour Top (no thermals): 79.96,38.51 78.13,38.51 77.11,37.49 71.12,37.49 71.12,39.83 78.03,39.83 79.25,38.61 79.96,38.61
VREF  (1 unrouted)
  Top 0.406: 89,53.24 U3.11 | U3.13 89.12,54.54 89.1,54.56
  Top 0.559: U$4.5 88.33,54.66 | 88.33,54.66 88.33,53.51 88.6,53.24 89,53.24 | 89.1,54.56 88.43,54.56 88.33,54.66
VSET
  Top 0.406: U3.14 93.39,55.19 93.85,55.65 IC2.3